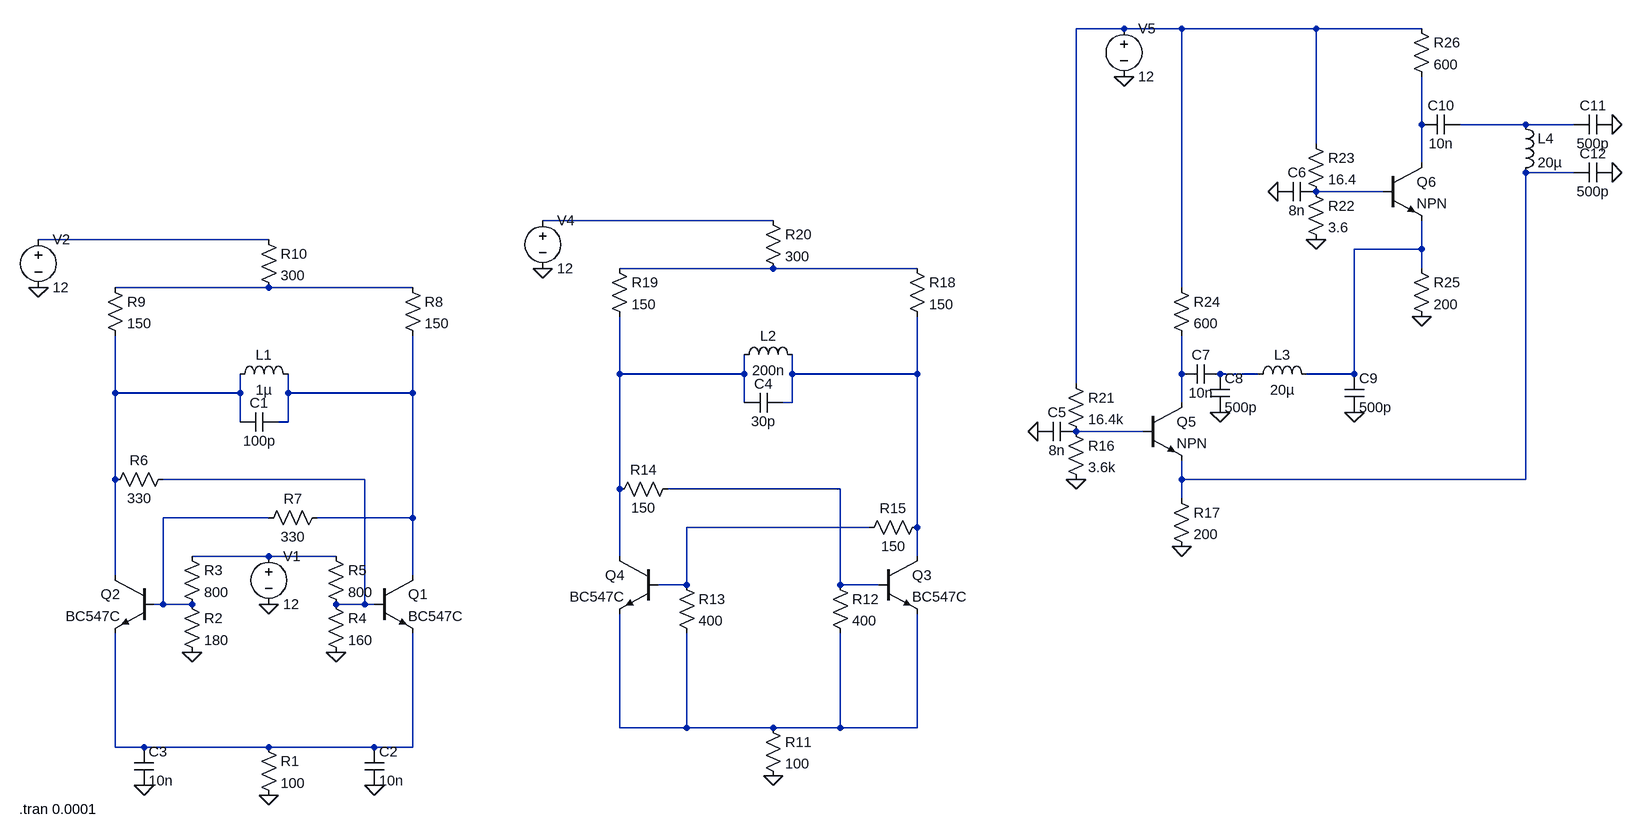
[diagram p0: schematic Oscillators.asc]
Oscillators.asc, the LTspice schematic file:
Version 4
SHEET 1 3476 680
WIRE 2624 -784 2544 -784
WIRE 2720 -784 2624 -784
WIRE 2944 -784 2720 -784
WIRE 3120 -784 2944 -784
WIRE 3120 -624 3120 -704
WIRE 3312 -624 3184 -624
WIRE 3392 -624 3312 -624
WIRE 2944 -592 2944 -784
WIRE 3120 -560 3120 -624
WIRE 3392 -544 3312 -544
WIRE 3056 -512 2944 -512
WIRE 1296 -464 912 -464
WIRE 192 -432 -192 -432
WIRE 3120 -416 3120 -464
WIRE 3120 -416 3008 -416
WIRE 1296 -384 1040 -384
WIRE 1536 -384 1296 -384
WIRE 3120 -384 3120 -416
WIRE 192 -352 -64 -352
WIRE 432 -352 192 -352
WIRE 2720 -352 2720 -784
WIRE 1040 -208 1040 -304
WIRE 1248 -208 1248 -240
WIRE 1248 -208 1040 -208
WIRE 1328 -208 1328 -240
WIRE 1536 -208 1536 -304
WIRE 1536 -208 1328 -208
WIRE 2720 -208 2720 -272
WIRE 2848 -208 2784 -208
WIRE 3008 -208 3008 -416
WIRE 3008 -208 2928 -208
WIRE 2544 -192 2544 -784
WIRE -64 -176 -64 -272
WIRE 144 -176 144 -208
WIRE 144 -176 -64 -176
WIRE 224 -176 224 -208
WIRE 432 -176 432 -272
WIRE 432 -176 224 -176
WIRE 1248 -160 1248 -208
WIRE 1328 -160 1328 -208
WIRE 1328 -160 1312 -160
WIRE 2720 -160 2720 -208
WIRE 144 -128 144 -176
WIRE 224 -128 224 -176
WIRE 224 -128 208 -128
WIRE 2656 -112 2544 -112
WIRE -64 -32 -64 -176
WIRE 352 -32 16 -32
WIRE 2720 -32 2720 -64
WIRE 3312 -32 3312 -544
WIRE 3312 -32 2720 -32
WIRE 1040 -16 1040 -208
WIRE 1408 -16 1120 -16
WIRE 2720 0 2720 -32
WIRE 192 32 16 32
WIRE 432 32 432 -176
WIRE 432 32 272 32
WIRE 1456 48 1152 48
WIRE 1536 48 1536 -208
WIRE 192 96 64 96
WIRE 304 96 192 96
WIRE 1040 96 1040 -16
WIRE 1536 96 1536 48
WIRE -64 128 -64 -32
WIRE 432 128 432 32
WIRE 1152 144 1152 48
WIRE 1152 144 1104 144
WIRE 1408 144 1408 -16
WIRE 1472 144 1408 144
WIRE 16 176 16 32
WIRE 16 176 0 176
WIRE 64 176 16 176
WIRE 352 176 352 -32
WIRE 352 176 304 176
WIRE 368 176 352 176
WIRE 1040 384 1040 192
WIRE 1152 384 1152 224
WIRE 1152 384 1040 384
WIRE 1296 384 1152 384
WIRE 1408 384 1408 224
WIRE 1408 384 1296 384
WIRE 1536 384 1536 192
WIRE 1536 384 1408 384
WIRE -64 416 -64 224
WIRE -16 416 -64 416
WIRE 192 416 -16 416
WIRE 368 416 192 416
WIRE 432 416 432 224
WIRE 432 416 368 416
FLAG 192 496 0
FLAG 64 256 0
FLAG 304 256 0
FLAG 192 176 0
FLAG -192 -352 0
FLAG -16 480 0
FLAG 368 480 0
FLAG 1296 464 0
FLAG 912 -384 0
FLAG 2480 -112 0
FLAG 2720 80 0
FLAG 2880 -512 0
FLAG 2944 -432 0
FLAG 2544 -32 0
FLAG 3120 -304 0
FLAG 2624 -704 0
FLAG 2784 -144 0
FLAG 3008 -144 0
FLAG 3456 -624 0
FLAG 3456 -544 0
SYMBOL npn 368 128 R0
SYMATTR InstName Q1
SYMATTR Value BC547C
SYMBOL npn 0 128 M0
SYMATTR InstName Q2
SYMATTR Value BC547C
SYMBOL res 176 400 R0
SYMATTR InstName R1
SYMATTR Value 100
SYMBOL res 48 160 R0
SYMATTR InstName R2
SYMATTR Value 180
SYMBOL res 48 80 R0
SYMATTR InstName R3
SYMATTR Value 800
SYMBOL res 288 160 R0
SYMATTR InstName R4
SYMATTR Value 160
SYMBOL res 288 80 R0
SYMATTR InstName R5
SYMATTR Value 800
SYMBOL res 32 -48 R90
WINDOW 0 0 56 VBottom 2
WINDOW 3 32 56 VTop 2
SYMATTR InstName R6
SYMATTR Value 330
SYMBOL voltage 192 80 R0
WINDOW 123 0 0 Left 0
WINDOW 39 0 0 Left 0
SYMATTR InstName V1
SYMATTR Value 12
SYMBOL res 288 16 R90
WINDOW 0 0 56 VBottom 2
WINDOW 3 32 56 VTop 2
SYMATTR InstName R7
SYMATTR Value 330
SYMBOL res 416 -368 R0
SYMATTR InstName R8
SYMATTR Value 150
SYMBOL res -80 -368 R0
SYMATTR InstName R9
SYMATTR Value 150
SYMBOL res 176 -448 R0
SYMATTR InstName R10
SYMATTR Value 300
SYMBOL voltage -192 -448 R0
WINDOW 123 0 0 Left 0
WINDOW 39 0 0 Left 0
SYMATTR InstName V2
SYMATTR Value 12
SYMBOL cap 208 -144 R90
WINDOW 0 0 32 VBottom 2
WINDOW 3 32 32 VTop 2
SYMATTR InstName C1
SYMATTR Value 100p
SYMBOL ind 128 -192 R270
WINDOW 0 32 56 VTop 2
WINDOW 3 5 56 VBottom 2
SYMATTR InstName L1
SYMATTR Value 1µ
SYMBOL cap 352 416 R0
SYMATTR InstName C2
SYMATTR Value 10n
SYMBOL cap -32 416 R0
SYMATTR InstName C3
SYMATTR Value 10n
SYMBOL res 1280 368 R0
SYMATTR InstName R11
SYMATTR Value 100
SYMBOL res 1520 -400 R0
SYMATTR InstName R18
SYMATTR Value 150
SYMBOL res 1024 -400 R0
SYMATTR InstName R19
SYMATTR Value 150
SYMBOL res 1280 -480 R0
SYMATTR InstName R20
SYMATTR Value 300
SYMBOL voltage 912 -480 R0
WINDOW 123 0 0 Left 0
WINDOW 39 0 0 Left 0
SYMATTR InstName V4
SYMATTR Value 12
SYMBOL cap 1312 -176 R90
WINDOW 0 0 32 VBottom 2
WINDOW 3 32 32 VTop 2
SYMATTR InstName C4
SYMATTR Value 30p
SYMBOL ind 1232 -224 R270
WINDOW 0 32 56 VTop 2
WINDOW 3 5 56 VBottom 2
SYMATTR InstName L2
SYMATTR Value 200n
SYMBOL res 1392 128 R0
SYMATTR InstName R12
SYMATTR Value 400
SYMBOL res 1136 128 R0
SYMATTR InstName R13
SYMATTR Value 400
SYMBOL res 1136 -32 R90
WINDOW 0 0 56 VBottom 2
WINDOW 3 32 56 VTop 2
SYMATTR InstName R14
SYMATTR Value 150
SYMBOL res 1552 32 R90
WINDOW 0 0 56 VBottom 2
WINDOW 3 32 56 VTop 2
SYMATTR InstName R15
SYMATTR Value 150
SYMBOL npn 1472 96 R0
SYMATTR InstName Q3
SYMATTR Value BC547C
SYMBOL npn 1104 96 M0
SYMATTR InstName Q4
SYMATTR Value BC547C
SYMBOL npn 2656 -160 R0
SYMATTR InstName Q5
SYMBOL npn 3056 -560 R0
SYMATTR InstName Q6
SYMBOL res 2528 -128 R0
SYMATTR InstName R16
SYMATTR Value 3.6k
SYMBOL res 2704 -16 R0
SYMATTR InstName R17
SYMATTR Value 200
SYMBOL res 2528 -208 R0
SYMATTR InstName R21
SYMATTR Value 16.4k
SYMBOL cap 2544 -128 R90
WINDOW 0 0 32 VBottom 2
WINDOW 3 32 32 VTop 2
SYMATTR InstName C5
SYMATTR Value 8n
SYMBOL res 2928 -528 R0
SYMATTR InstName R22
SYMATTR Value 3.6
SYMBOL res 2928 -608 R0
SYMATTR InstName R23
SYMATTR Value 16.4
SYMBOL cap 2944 -528 R90
WINDOW 0 0 32 VBottom 2
WINDOW 3 32 32 VTop 2
SYMATTR InstName C6
SYMATTR Value 8n
SYMBOL res 2704 -368 R0
SYMATTR InstName R24
SYMATTR Value 600
SYMBOL res 3104 -400 R0
SYMATTR InstName R25
SYMATTR Value 200
SYMBOL res 3104 -800 R0
SYMATTR InstName R26
SYMATTR Value 600
SYMBOL voltage 2624 -800 R0
WINDOW 123 0 0 Left 0
WINDOW 39 0 0 Left 0
SYMATTR InstName V5
SYMATTR Value 12
SYMBOL cap 2784 -224 R90
WINDOW 0 0 32 VBottom 2
WINDOW 3 32 32 VTop 2
SYMATTR InstName C7
SYMATTR Value 10n
SYMBOL cap 2768 -208 R0
SYMATTR InstName C8
SYMATTR Value 500p
SYMBOL ind 2832 -192 R270
WINDOW 0 32 56 VTop 2
WINDOW 3 5 56 VBottom 2
SYMATTR InstName L3
SYMATTR Value 20µ
SYMBOL cap 2992 -208 R0
SYMATTR InstName C9
SYMATTR Value 500p
SYMBOL cap 3184 -640 R90
WINDOW 0 0 32 VBottom 2
WINDOW 3 32 32 VTop 2
SYMATTR InstName C10
SYMATTR Value 10n
SYMBOL ind 3296 -640 R0
SYMATTR InstName L4
SYMATTR Value 20µ
SYMBOL cap 3456 -640 R90
WINDOW 0 0 32 VBottom 2
WINDOW 3 32 32 VTop 2
SYMATTR InstName C11
SYMATTR Value 500p
SYMBOL cap 3456 -560 R90
WINDOW 0 0 32 VBottom 2
WINDOW 3 32 32 VTop 2
SYMATTR InstName C12
SYMATTR Value 500p
TEXT -224 520 Left 2 !.tran 0.0001

The netlist it stands for:
* Oscillators.asc
Q1 N016 N018 N024 0 BC547C
Q2 N015 N020 N024 0 BC547C
R1 N024 0 100
R2 N020 0 180
R3 N022 N020 800
R4 N018 0 160
R5 N022 N018 800
R6 N018 N015 330
V1 N022 0 12
R7 N016 N020 330
R8 N010 N016 150
R9 N010 N015 150
R10 N007 N010 300
V2 N007 0 12
C1 N016 N015 100p
L1 N015 N016 1µ
C2 N024 0 10n
C3 N024 0 10n
R11 N023 0 100
R18 N009 N012 150
R19 N009 N011 150
R20 N006 N009 300
V4 N006 0 12
C4 N012 N011 30p
L2 N011 N012 200n
R12 N019 N023 400
R13 N021 N023 400
R14 N019 N011 150
R15 N012 N021 150
Q3 N012 N019 N023 0 BC547C
Q4 N011 N021 N023 0 BC547C
Q5 N013 N017 N004 0 NPN
Q6 N002 N005 N008 0 NPN
R16 N017 0 3.6k
R17 N004 0 200
R21 N001 N017 16.4k
C5 N017 0 8n
R22 N005 0 3.6
R23 N001 N005 16.4
C6 N005 0 8n
R24 N001 N013 600
R25 N008 0 200
R26 N001 N002 600
V5 N001 0 12
C7 N014 N013 10n
C8 N014 0 500p
L3 N014 N008 20µ
C9 N008 0 500p
C10 N003 N002 10n
L4 N003 N004 20µ
C11 0 N003 500p
C12 0 N004 500p
.model NPN NPN
.model PNP PNP
.lib standard.bjt
.tran 0.0001
.backanno
.end